# EAGLE design doorbell (EAGLE 7.7.0)
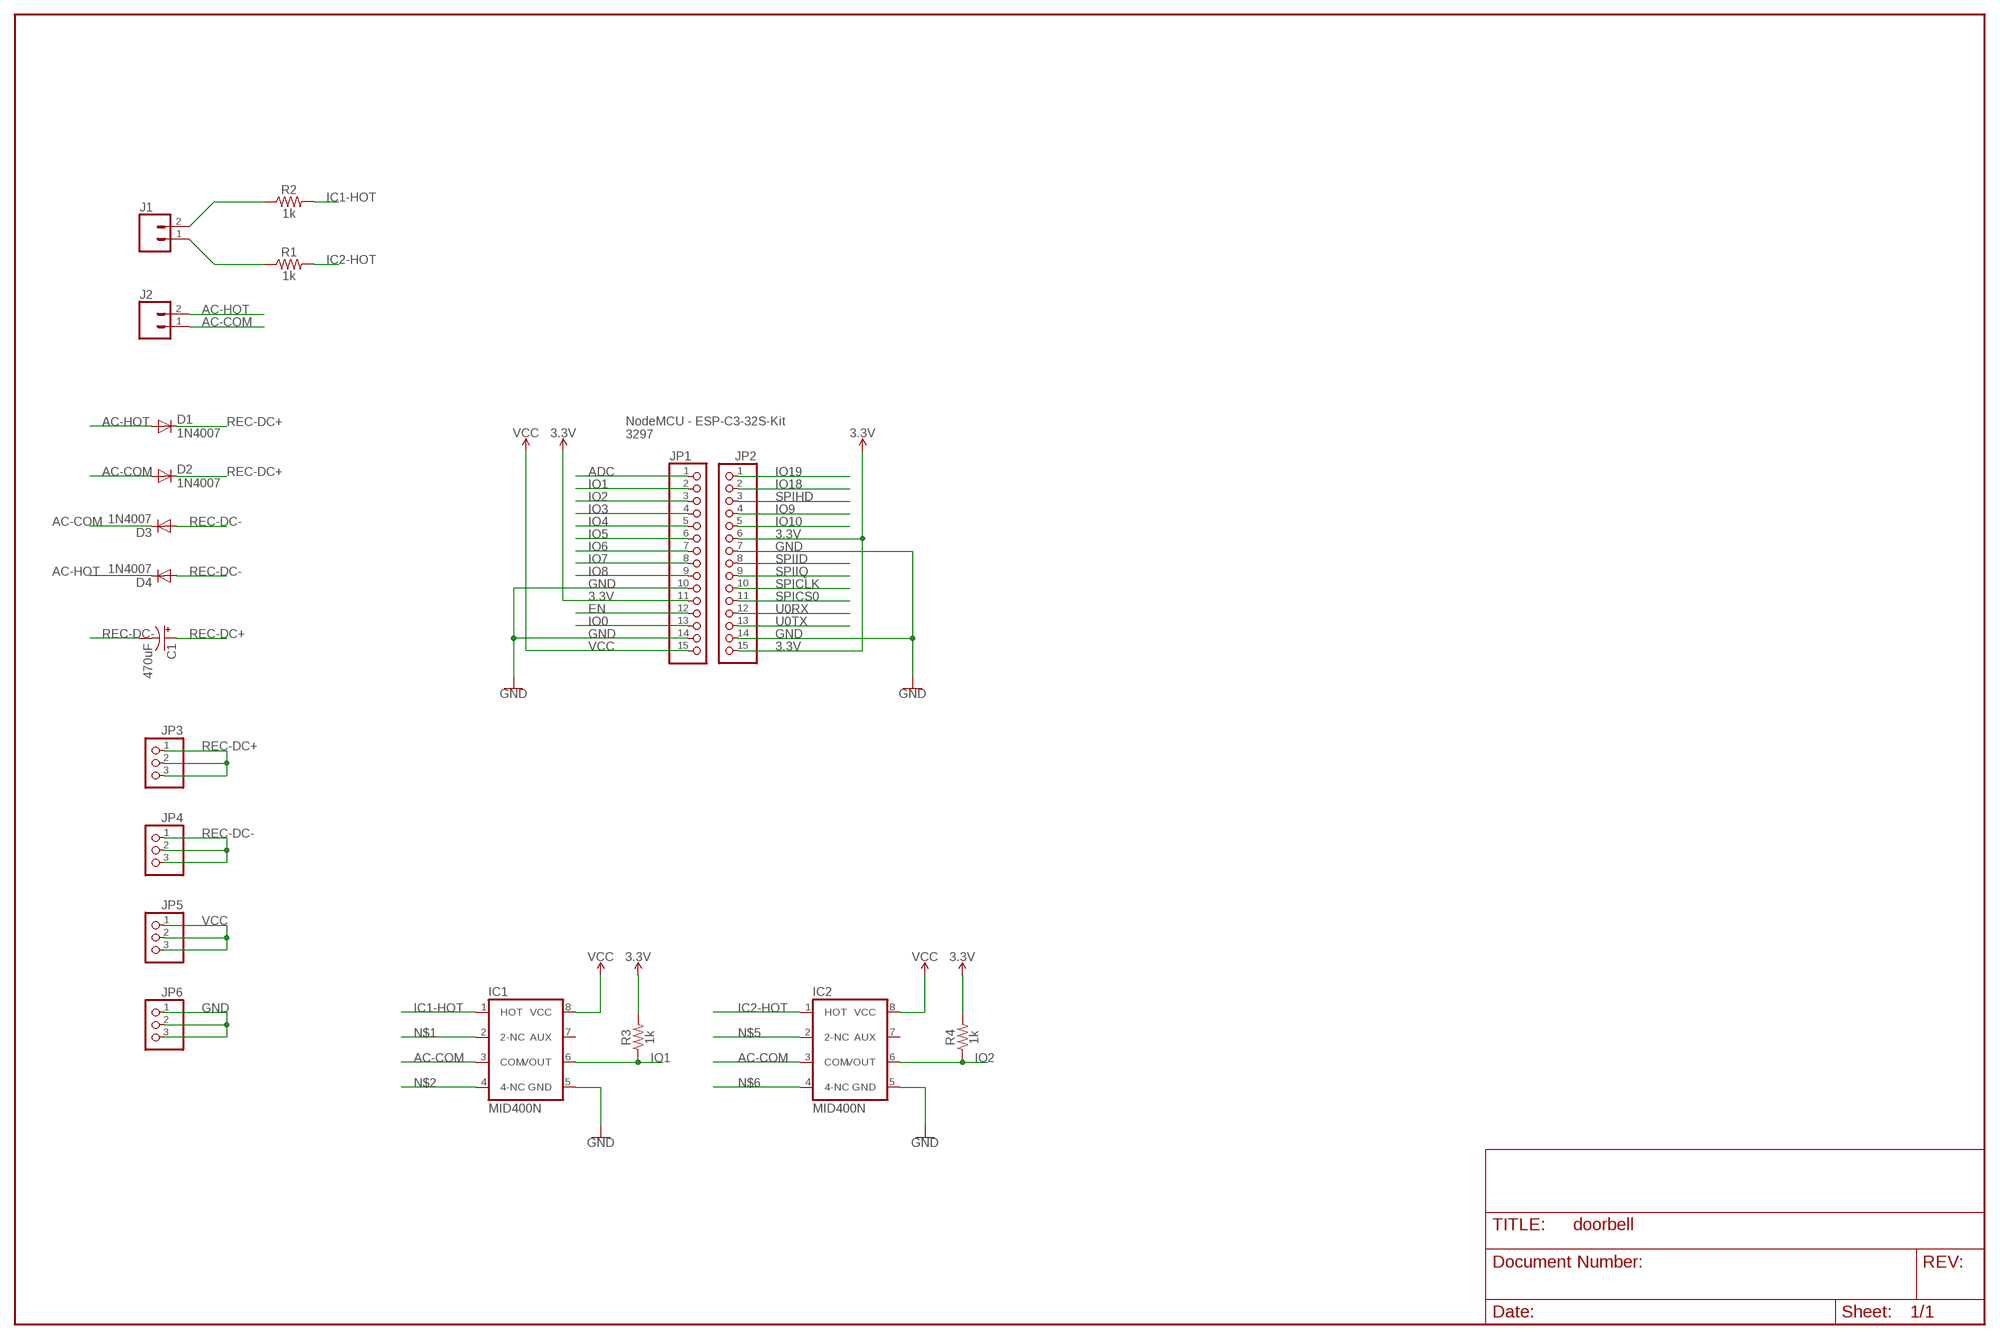
[diagram p0: schematic, sheet 1]

## Parts
C1  470uF  CPOL-USE7.5-18  [E7,5-18]
D1  1N4007  1N4004  [DO41-10]
D2  1N4007  1N4004  [DO41-10]
D3  1N4007  1N4004  [DO41-10]
D4  1N4007  1N4004  [DO41-10]
IC1  MID400N  [DIL08-ROUND]
IC2  MID400N  [DIL08-ROUND]
J1  CONN_023.5MM  [SCREWTERMINAL-3.5MM-2]
J2  CONN_023.5MM  [SCREWTERMINAL-3.5MM-2]
JP1  PINHD-1X15  [1X15]
JP2  PINHD-1X15  [1X15]
JP3  PINHD-1X3  [1X03]
JP4  PINHD-1X3  [1X03]
JP5  PINHD-1X3  [1X03]
JP6  PINHD-1X3  [1X03]
R1  1k  1KOHM-HORIZ-1/4W-1%  [AXIAL-0.3]
R2  1k  1KOHM-HORIZ-1/4W-1%  [AXIAL-0.3]
R3  1k  1KOHM-HORIZ-1/4W-1%  [AXIAL-0.3]
R4  1k  1KOHM-HORIZ-1/4W-1%  [AXIAL-0.3]

## Nets
3.3V: JP1.11 JP2.6 JP2.15 R3.P$2 R4.P$2
AC-COM: D2.A D3.C IC1.3(COM) IC2.3(COM) J2.1
AC-HOT: D1.A D4.C J2.2
ADC: JP1.1
EN: JP1.12
GND: IC1.5(GND) IC2.5(GND) JP1.10 JP1.14 JP2.7 JP2.14 JP6.1 JP6.2 JP6.3
IC1-HOT: IC1.1(HOT) R2.P$2
IC2-HOT: IC2.1(HOT) R1.P$2
IO0: JP1.13
IO1: IC1.6(VOUT) JP1.2 R3.P$1
IO2: IC2.6(VOUT) JP1.3 R4.P$1
IO3: JP1.4
IO4: JP1.5
IO5: JP1.6
IO6: JP1.7
IO7: JP1.8
IO8: JP1.9
IO9: JP2.4
IO10: JP2.5
IO18: JP2.2
IO19: JP2.1
N$1: IC1.2(2-NC)
N$2: IC1.4(4-NC)
N$3: J1.1 R1.P$1
N$4: J1.2 R2.P$1
N$5: IC2.2(2-NC)
N$6: IC2.4(4-NC)
REC-DC+: C1.+ D1.C D2.C JP3.1 JP3.2 JP3.3
REC-DC-: C1.- D3.A D4.A JP4.1 JP4.2 JP4.3
SPICLK: JP2.10
SPICS0: JP2.11
SPIHD: JP2.3
SPIID: JP2.8
SPIIQ: JP2.9
U0RX: JP2.12
U0TX: JP2.13
VCC: IC1.8(VCC) IC2.8(VCC) JP1.15 JP5.1 JP5.2 JP5.3
Unconnected: IC1.7(AUX) IC2.7(AUX)

## Notes on the sheet
- NodeMCU - ESP-C3-32S-Kit
  3297

## Library data of the parts
C1 = adafruit:CPOL-US: POLARIZED CAPACITOR, American symbol
D1-D4 = adafruit:1N4004: DIODE General purpose 1N400x type rectifier (With bigger pads) http://www.ladyada.net/library/pcb/eaglelibrary.html
IC1 IC2 = random parts:MID400: MID400
J1 J2 = SparkFun-Connectors:CONN_02: Multi connection point. Often used as Generic Header-pin footprint for 0.1 inch spaced/style header connections On any of the 0.1 inch spaced packages, you can populate with these: Break Away Headers - Straight <https://www.sparkfun.com/products/116> (PRT-00116) Break Away Male Headers - Right Angle <https://www.sparkfun.com/products/553> (PRT-00553) Female Headers <https://www.sparkfun.com/products/115> (PRT-00115) Break Away Headers - Machine Pin <https://www.sparkfun.com/products/117> (PRT-00117) Break Away Female Headers - Swiss Machine Pin <https://www.sparkfun.com/products/743> (PRT-00743) For SCREWTERMINALS and SPRING TERMINALS visit here: Screw Terimnals on SparkFun.com <https://www.sparkfun.com/search/results?term=Screw+Terminals> (5mm/3.5mm/2.54mm spacing) This device is also useful as a general connection point to wire up your design to another part of your project. Our various solder wires solder well into these plated through hole pads. Hook-Up Wire - Assortment (Stranded, 22 AWG) <https://www.sparkfun.com/products/11375> (PRT-11375) Hook-Up Wire - Assortment (Solid Core, 22 AWG) <https://www.sparkfun.com/products/11367> (PRT-11367) View the entire wire category on our website here <https://www.sparkfun.com/categories/141> Special notes: Molex polarized connector foot print use with: PRT-08233 with associated crimp pins and housings. 2.54_SCREWTERM for use with PRT-10571. 3.5mm Screw Terminal footprints for PRT-08084 5mm Screw Terminal footprints for use with PRT-08432; PROD_ID: CONN-08399
JP1 JP2 = pinhead+:PINHD-1X15: PIN HEADER
JP3-JP6 = pinhead:PINHD-1X3: PIN HEADER
R1-R4 = SparkFun-Resistors:1KOHM: 1kΩ resistor A resistor is a passive two-terminal electrical component that implements electrical resistance as a circuit element. Resistors act to reduce current flow, and, at the same time, act to lower voltage levels within circuits. - Wikipedia; PROD_ID: RES-12182

## Board
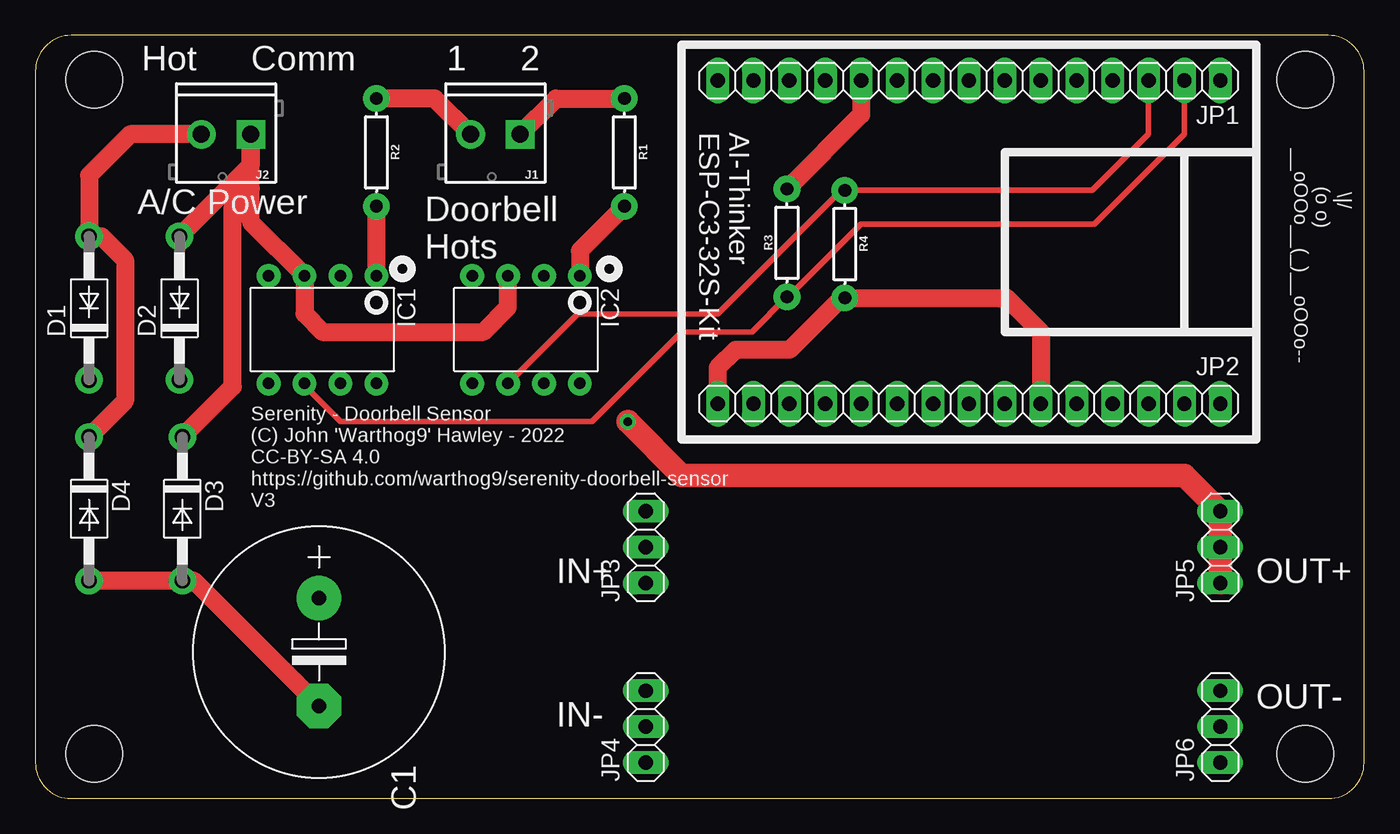
[diagram p1: board, top side]
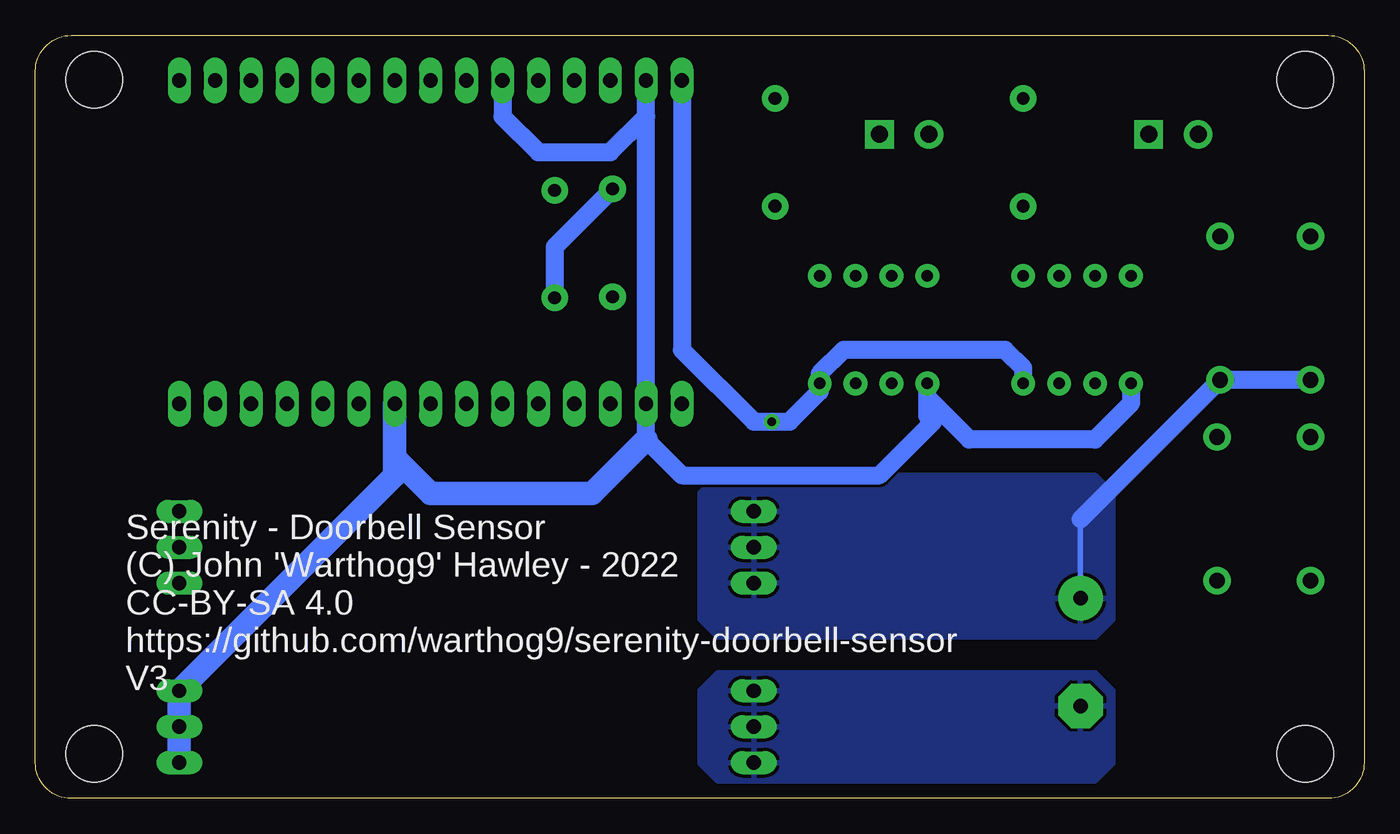
[diagram p2: board, bottom side, seen from below]

Size 94 x 54 mm. Coordinates in mm from the lower left corner, seen from the top.
Outline: 2.54,0 91.46,0 arc90 94,2.54 94,51.46 arc90 91.46,54 2.54,54 arc90 0,51.46 0,2.54 arc90 2.54,0
Copper layers (1*16): Top 0.035mm / dielectric 1.5mm / Bottom 0.035mm
Design rules "SparkFun": minimum track width 8mil, minimum drill 20mil, track to track 8mil, track to pad 8mil, pad to pad 8mil, via to via 8mil, smd to smd 8mil, copper to edge 10mil, drill to drill 8mil, minimum pad ring 12mil, minimum via ring 10mil, stop-mask expansion 4mil, vias tented up to drill 25mil, thermal gap 10mil
Holes 4 mm at 4.16,50.87 4.16,3.16 89.84,50.87 89.84,3.16

### Footprints (pad centres in the part's own frame; a part is rotated, then mirrored left to right if it is on the bottom)
E7,5-18 = drill 1.016 pad 3.15: + -3.81,0 | drill 1.016 pad 3.15 octagon: - 3.81,0
DO41-10 = drill 1.118 pad 1.93: A 5.08,0; C -5.08,0
DIL08-ROUND = drill 0.813 pad 1.676: 1 -3.81,-3.81; 2 -1.27,-3.81; 3 1.27,-3.81; 4 3.81,-3.81; 5 3.81,3.81; 6 1.27,3.81; 7 -1.27,3.81; 8 -3.81,3.81
SCREWTERMINAL-3.5MM-2 = drill 1.2 pad 2.032 square: 1 0,0 | drill 1.2 pad 2.032: 2 3.5,0
1X15 = drill 1.016 long: 1 -17.78,0; 2 -15.24,0; 3 -12.7,0; 4 -10.16,0; 5 -7.62,0; 6 -5.08,0; 7 -2.54,0; 8 0,0; 9 2.54,0; 10 5.08,0; 11 7.62,0; 12 10.16,0; 13 12.7,0; 14 15.24,0; 15 17.78,0
1X03 = drill 1.016 long: 1 -2.54,0; 2 0,0; 3 2.54,0
AXIAL-0.3 = drill 0.9 pad 1.88: P$1 -3.81,0; P$2 3.81,0

### Placement (x,y rotation side)
C1  20.07,10.36 270 top
D1  3.8,34.7 90 top
D2  10.2,34.7 90 top
D3  10.4,20.5 270 top
D4  3.8,20.5 270 top
IC1  20.31,33.18 180 top
IC2  34.71,33.18 180 top
J1  34.29,46.99 180 top
J2  15.24,46.99 180 top
JP1  66.04,50.8 180 top
JP2  66.04,27.94 180 top
JP3  43.18,17.78 90 top
JP4  43.18,5.08 90 top
JP5  83.82,17.78 90 top
JP6  83.82,5.08 90 top
R1  41.67,45.72 270 top
R2  24.13,45.72 270 top
R3  53.17,39.32 90 top
R4  57.27,39.23 270 top

### Tracks (layer width: path | path; a pad name or v marks a point on that pad's centre or on a via)
3.3V
  Top 1.27: JP2.15 48.26,30.48 49.53,31.75 53.34,31.75 57.01,35.42 R4.P$2 68.72,35.42 71.12,33.02 JP2.6 | JP1.11 58.42,48.38 R3.P$2
  Bottom 1.27: R3.P$2 57.27,39.03 R4.P$2
AC-COM
  Top 1.27: IC2.3 33.44,34.76 31.7,33.02 20.32,33.02 19.04,34.3 IC1.3 15.24,40.79 J2.1 | J2.1 15.24,44.82 D2.A | D3.C 13.97,29.15 13.97,41.91 15.24,43.18 J2.1
AC-HOT
  Top 1.27: D4.C 6.35,28.13 6.35,38.1 4.67,39.78 D1.A 3.81,44.09 6.71,46.99 J2.2
GND
  Bottom 1.27: 50.8,48.26 JP2.14 50.8,25.4 48.26,22.86 34.29,22.86 30.48,26.67 30.9,27.09 IC2.5 30.9,28.36 27.94,25.4 19.05,25.4 16.5,27.95 IC1.5 | 50.8,48.26 JP1.14 | JP1.10 60.96,48.26 58.42,45.72 53.34,45.72 50.8,48.26
  Bottom 1.676: JP6.1 JP6.2 JP6.3 68.58,22.86 JP2.7 68.58,24.13 66.04,21.59 54.61,21.59 50.8,25.4
IC1-HOT
  Top 1.27: R2.P$2 24.12,41.9 IC1.1
IC2-HOT
  Top 1.27: R1.P$2 38.52,38.76 IC2.1
IO1
  Top 0.406: IC1.6 19.04,29.22 21.59,26.67 39.37,26.67 45.72,33.02 50.68,33.02 R3.P$1 53.29,35.51 58.42,40.64 74.93,40.64 81.28,46.99 JP1.2
IO2
  Top 0.406: IC2.6 38.36,34.29 48.26,34.29 57.01,43.04 R4.P$1 74.79,43.04 78.74,46.99 JP1.3
N$3
  Top 1.27: J1.1 36.83,49.53 R1.P$1
N$4
  Top 1.27: J1.2 28.25,49.53 R2.P$1
REC-DC+
  Bottom 0.406: 20.07,19.75 C1.+
  Bottom 1.27: D1.C D2.C 20.07,19.75
  pour Bottom: 19.05,11.43 45.72,11.43 46.99,12.7 46.99,21.59 45.72,22.86 19.05,22.86 17.78,21.59 17.78,12.7
REC-DC-
  Top 1.27: D4.A D3.A 11.2,15.42 C1.-
  pour Bottom: 19.05,8.89 21.59,8.89 45.72,8.89 46.99,7.62 46.99,2.54 45.72,1.27 19.05,1.27 17.78,2.54 17.78,7.62
VCC  (via drill 0.6)
  Top 1.676: JP5.1 JP5.2 JP5.3 81.28,22.86 45.72,22.86 v41.91,26.67
  Bottom 1.27: JP1.15 48.26,31.75 43.18,26.67 v41.91,26.67 40.64,26.67 38.52,28.79 IC2.8 | 38.68,29.21 IC2.8 | IC1.8 24.13,29.38 24.13,30.48 25.4,31.75 36.83,31.75 38.52,30.06 IC2.8

### Text on the board
tPlace: Hot | Comm | 1 | 2 | AI-Thinker / ESP-C3-32S-Kit | \\|/ / (o o) / __oOOo__(_)__oOOo-- | Doorbell / Hots | A/C Power | Serenity - Doorbell Sensor / (C) John 'Warthog9' Hawley - 2022 / CC-BY-SA 4.0 / https://github.com/warthog9/serenity-doorbell-sensor / V3 | IN+ | OUT+ | OUT- | IN-
bPlace: Serenity - Doorbell Sensor / (C) John 'Warthog9' Hawley - 2022 / CC-BY-SA 4.0 / https://github.com/warthog9/serenity-doorbell-sensor / V3